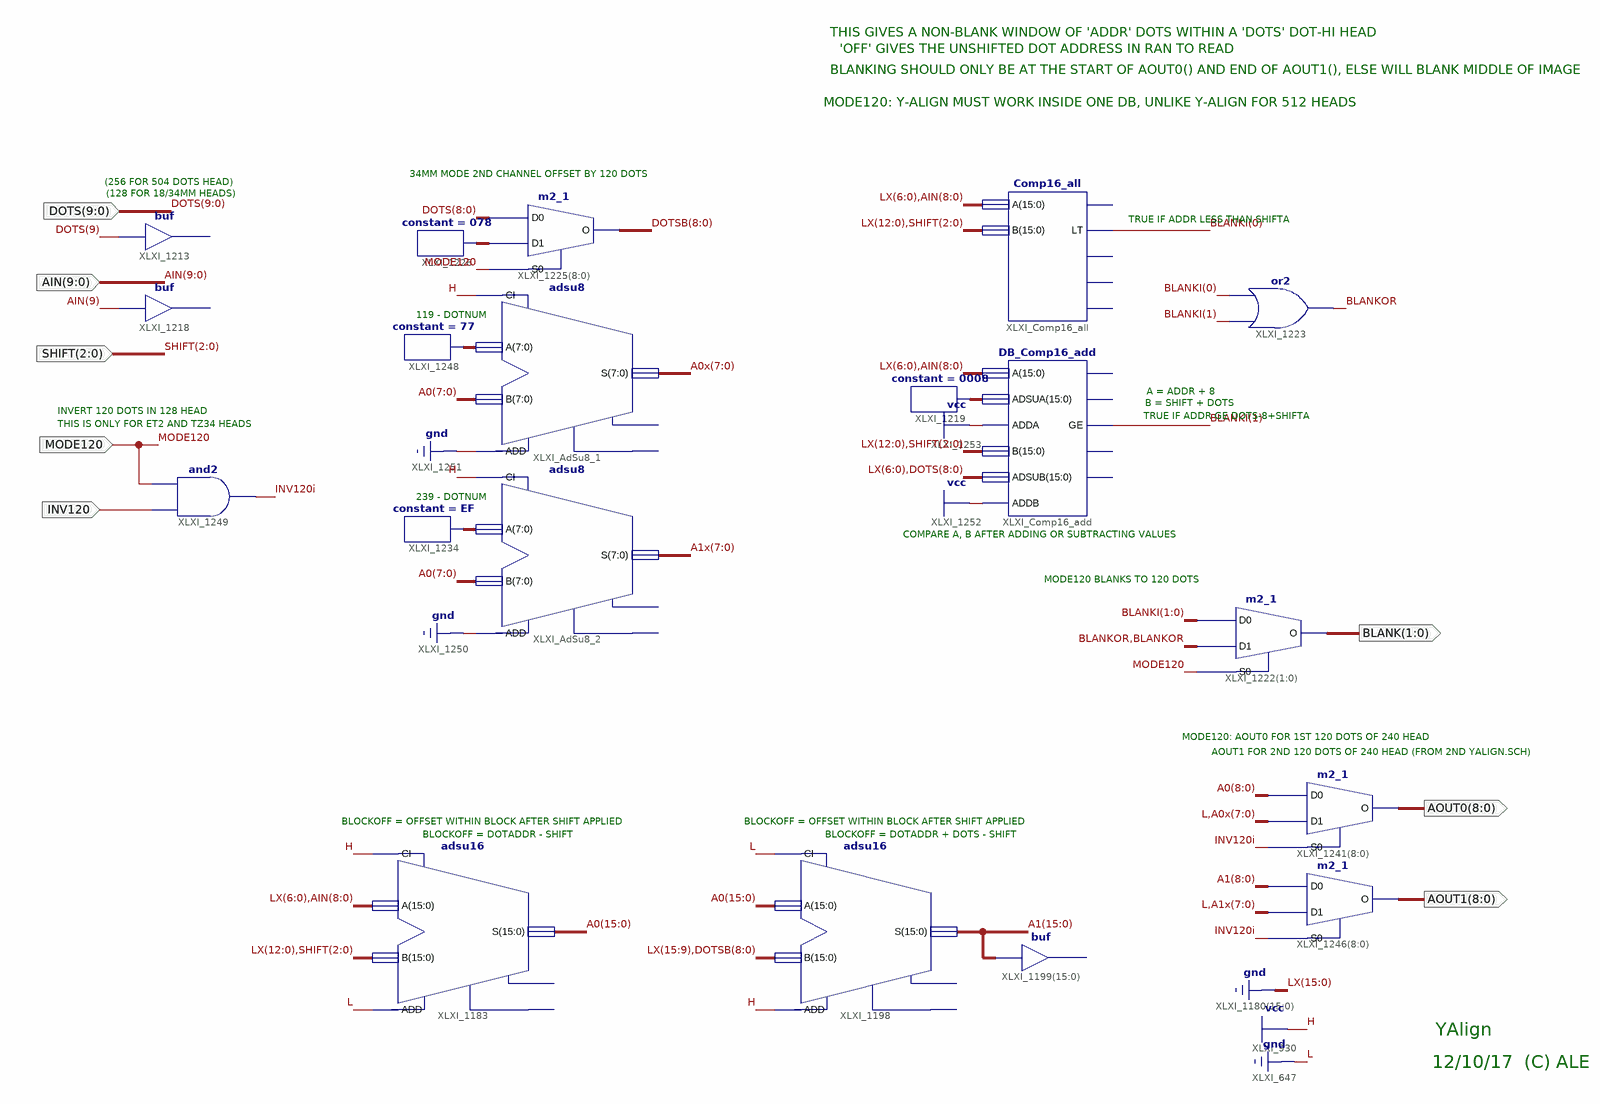
[diagram p0: schematic sheet 1]
// Xilinx ISE schematic DB_YAlign.sch (spartan3e) as structural Verilog: 19 symbols, 8 ports
module DB_YAlign (
  input  [2:0] SHIFT,
  input  [9:0] AIN,
  input  MODE120,
  input  [9:0] DOTS,
  input  INV120,
  output [1:0] BLANK,
  output [8:0] AOUT0,
  output [8:0] AOUT1
);

  wire BLANKOR, INV120i;
  wire [1:0] BLANKI;
  wire [7:0] A0x, A1x, XLXN_108, XLXN_109;
  wire [8:0] DOTSB, XLXN_53;
  wire [15:0] A0, A1, XLXN_35;

  Comp16_all XLXI_Comp16_all (
    .A({{7{1'b0}}, AIN[8:0]}), .B({{13{1'b0}}, SHIFT}), .LT(BLANKI[0]));  // open: EQ, GE, GT, LE
  DB_Comp16_add XLXI_Comp16_add (
    .A({{7{1'b0}}, AIN[8:0]}), .ADDA(1'b1), .ADDB(1'b1), .ADSUA(XLXN_35), .ADSUB({{7{1'b0}}, DOTS[8:0]}),
    .B({{13{1'b0}}, SHIFT}), .GE(BLANKI[1]));  // open: EQ, GT, LE, LT
  // buf XLXI_1213 has open pins: I=DOTS[9], O=open
  adsu16 XLXI_1198 (.A(A0), .ADD(1'b1), .B({{7{1'b0}}, DOTSB}), .CI(1'b0), .S(A1));  // open: CO, OFL
  // buf XLXI_1199[15..0] has open pins: I=A1, O=open
  adsu16 XLXI_1183 (
    .A({{7{1'b0}}, AIN[8:0]}), .ADD(1'b0), .B({{13{1'b0}}, SHIFT}), .CI(1'b1), .S(A0));  // open: CO, OFL
  // buf XLXI_1218 has open pins: I=AIN[9], O=open
  constant #(.CValue("0008")) XLXI_1219 (.O(XLXN_35));
  m2_1 XLXI_1222[1:0] (.D0(BLANKI), .D1({2{BLANKOR}}), .S0(MODE120), .O(BLANK));
  or XLXI_1223 (BLANKOR, BLANKI[1], BLANKI[0]);
  m2_1 XLXI_1225[8:0] (.D0(DOTS[8:0]), .D1(XLXN_53), .S0(MODE120), .O(DOTSB));
  constant #(.CValue("078")) XLXI_1226 (.O(XLXN_53));
  constant #(.CValue("EF")) XLXI_1234 (.O(XLXN_108));
  adsu8 XLXI_AdSu8_2 (.A(XLXN_108), .ADD(1'b0), .B(A0[7:0]), .CI(1'b1), .S(A1x));  // open: CO, OFL
  adsu8 XLXI_AdSu8_1 (.A(XLXN_109), .ADD(1'b0), .B(A0[7:0]), .CI(1'b1), .S(A0x));  // open: CO, OFL
  m2_1 XLXI_1241[8:0] (.D0(A0[8:0]), .D1({1'b0, A0x}), .S0(INV120i), .O(AOUT0));
  m2_1 XLXI_1246[8:0] (.D0(A1[8:0]), .D1({1'b0, A1x}), .S0(INV120i), .O(AOUT1));
  constant #(.CValue("77")) XLXI_1248 (.O(XLXN_109));
  and XLXI_1249 (INV120i, INV120, MODE120);

  // Notes on the sheet:
  //   THIS GIVES A NON-BLANK WINDOW OF 'ADDR' DOTS WITHIN A 'DOTS' DOT-HI HEAD
  //   'OFF' GIVES THE UNSHIFTED DOT ADDRESS IN RAN TO READ
  //   BLANKING SHOULD ONLY BE AT THE START OF AOUT0() AND END OF AOUT1(), ELSE WILL BLANK MIDDLE OF IMAGE
  //   MODE120: Y-ALIGN MUST WORK INSIDE ONE DB, UNLIKE Y-ALIGN FOR 512 HEADS
  //   34MM MODE 2ND CHANNEL OFFSET BY 120 DOTS
  //   (256 FOR 504 DOTS HEAD)
  //   (128 FOR 18/34MM HEADS)
  //   TRUE IF ADDR LESS THAN SHIFTA
  //   119 - DOTNUM
  //   A = ADDR + 8
  //   B = SHIFT + DOTS
  //   INVERT 120 DOTS IN 128 HEAD
  //   TRUE IF ADDR GE DOTS-8+SHIFTA
  //   THIS IS ONLY FOR ET2 AND TZ34 HEADS
  //   239 - DOTNUM
  //   COMPARE A, B AFTER ADDING OR SUBTRACTING VALUES
  //   MODE120 BLANKS TO 120 DOTS
  //   MODE120: AOUT0 FOR 1ST 120 DOTS OF 240 HEAD
  //   AOUT1 FOR 2ND 120 DOTS OF 240 HEAD (FROM 2ND YALIGN.SCH)
  //   BLOCKOFF = OFFSET WITHIN BLOCK AFTER SHIFT APPLIED
  //   BLOCKOFF = OFFSET WITHIN BLOCK AFTER SHIFT APPLIED
  //   BLOCKOFF = DOTADDR - SHIFT
  //   BLOCKOFF = DOTADDR + DOTS - SHIFT
  //   YAlign
  //   12/10/17  (C) ALE
endmodule
